# EAGLE schematic MacroPad (EAGLE 9.6.2)
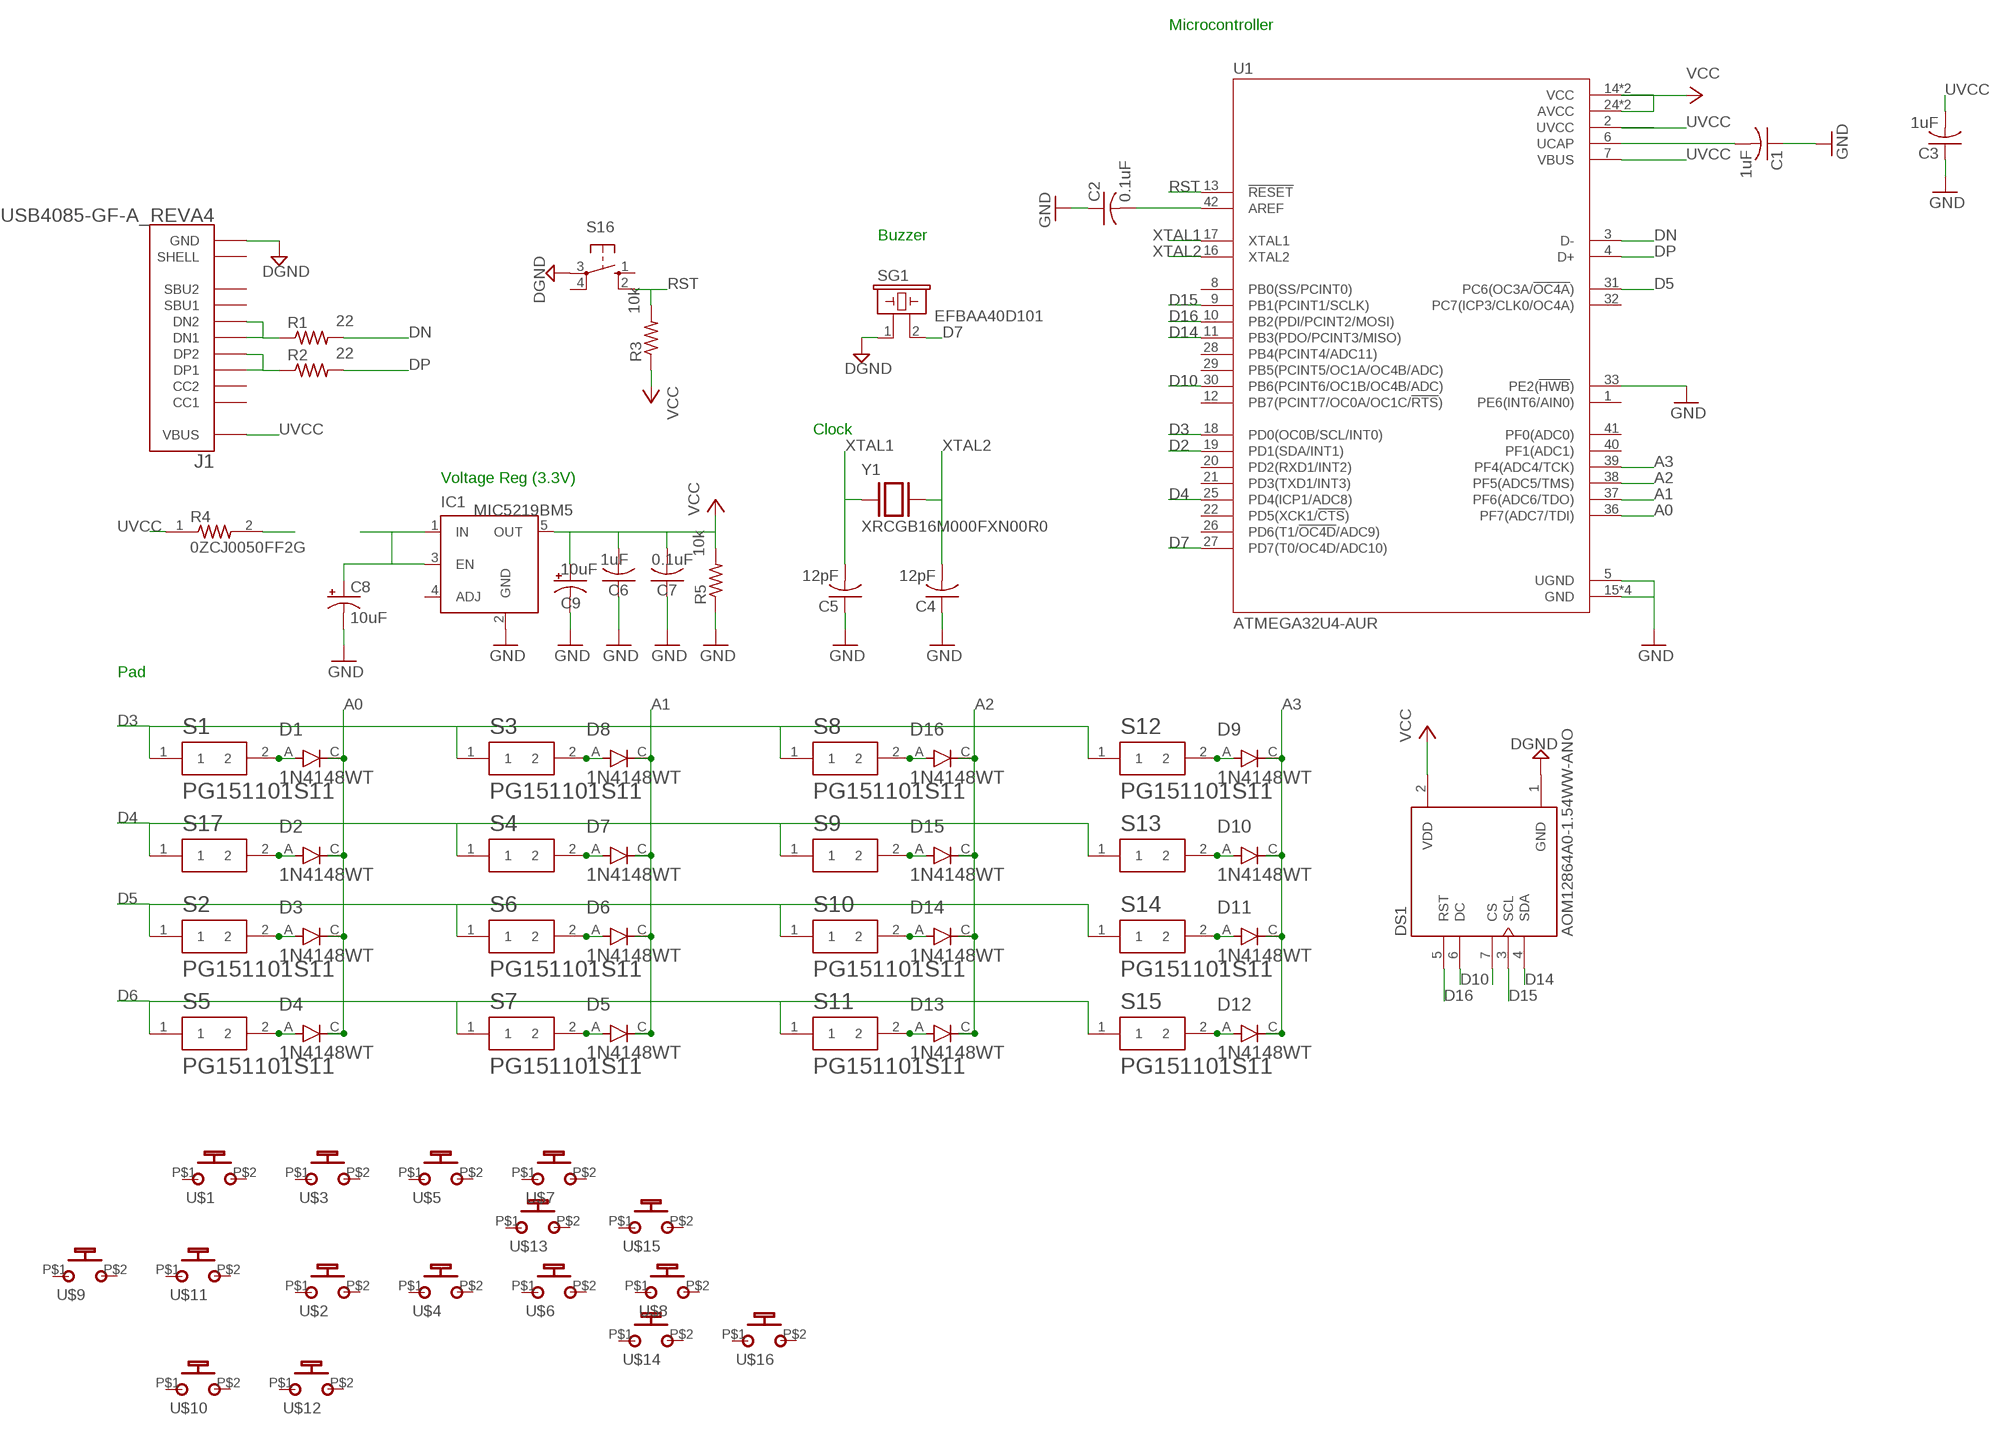
[diagram p0: schematic, sheet 1]

## Parts
C1  1uF  C-USC0603  [C0603]
C2  0.1uF  C-USC0603  [C0603]
C3  1uF  C-USC0603  [C0603]
C4  12pF  C-USC0603  [C0603]
C5  12pF  C-USC0603  [C0603]
C6  1uF  C-USC0603  [C0603]
C7  0.1uF  C-USC0603  [C0603]
C8  10uF  CPOL-US153CLV-0605  [153CLV-0605]
C9  10uF  CPOL-US153CLV-0605  [153CLV-0605]
D1  1N4148WT  [SODFL1608X70N]
D2  1N4148WT  [SODFL1608X70N]
D3  1N4148WT  [SODFL1608X70N]
D4  1N4148WT  [SODFL1608X70N]
D5  1N4148WT  [SODFL1608X70N]
D6  1N4148WT  [SODFL1608X70N]
D7  1N4148WT  [SODFL1608X70N]
D8  1N4148WT  [SODFL1608X70N]
D9  1N4148WT  [SODFL1608X70N]
D10  1N4148WT  [SODFL1608X70N]
D11  1N4148WT  [SODFL1608X70N]
D12  1N4148WT  [SODFL1608X70N]
D13  1N4148WT  [SODFL1608X70N]
D14  1N4148WT  [SODFL1608X70N]
D15  1N4148WT  [SODFL1608X70N]
D16  1N4148WT  [SODFL1608X70N]
DS1  AOM12864A0-1.54WW-ANO  [LCD_AOM12864A0-1.54WW-ANO]
IC1  MIC5219BM5  [SOT23-5]
J1  USB4085-GF-A_REVA4  [GCT_USB4085-GF-A_REVA4]
R1  22  R-US_R0805  [R0805]
R2  22  R-US_R0805  [R0805]
R3  10k  R-US_R0805  [R0805]
R4  0ZCJ0050FF2G  [RESC3216X125N]
R5  10k  R-US_R0805  [R0805]
S1  PG151101S11  [SW_PG151101S11]
S2  PG151101S11  [SW_PG151101S11]
S3  PG151101S11  [SW_PG151101S11]
S4  PG151101S11  [SW_PG151101S11]
S5  PG151101S11  [SW_PG151101S11]
S6  PG151101S11  [SW_PG151101S11]
S7  PG151101S11  [SW_PG151101S11]
S8  PG151101S11  [SW_PG151101S11]
S9  PG151101S11  [SW_PG151101S11]
S10  PG151101S11  [SW_PG151101S11]
S11  PG151101S11  [SW_PG151101S11]
S12  PG151101S11  [SW_PG151101S11]
S13  PG151101S11  [SW_PG151101S11]
S14  PG151101S11  [SW_PG151101S11]
S15  PG151101S11  [SW_PG151101S11]
S16  10-XX  [B3F-10XX]
S17  PG151101S11  [SW_PG151101S11]
SG1  EFBAA40D101  [EFBAA40D101]
U1  ATMEGA32U4-AUR  [QFP80P1200X1200X120-44N]
U$1  MX1A-11NN  [CHERRY_MX1A-11NN_SWITCH]
U$2  MX1A-11NN  [CHERRY_MX1A-11NN_SWITCH]
U$3  MX1A-11NN  [CHERRY_MX1A-11NN_SWITCH]
U$4  MX1A-11NN  [CHERRY_MX1A-11NN_SWITCH]
U$5  MX1A-11NN  [CHERRY_MX1A-11NN_SWITCH]
U$6  MX1A-11NN  [CHERRY_MX1A-11NN_SWITCH]
U$7  MX1A-11NN  [CHERRY_MX1A-11NN_SWITCH]
U$8  MX1A-11NN  [CHERRY_MX1A-11NN_SWITCH]
U$9  MX1A-11NN  [CHERRY_MX1A-11NN_SWITCH]
U$10  MX1A-11NN  [CHERRY_MX1A-11NN_SWITCH]
U$11  MX1A-11NN  [CHERRY_MX1A-11NN_SWITCH]
U$12  MX1A-11NN  [CHERRY_MX1A-11NN_SWITCH]
U$13  MX1A-11NN  [CHERRY_MX1A-11NN_SWITCH]
U$14  MX1A-11NN  [CHERRY_MX1A-11NN_SWITCH]
U$15  MX1A-11NN  [CHERRY_MX1A-11NN_SWITCH]
U$16  MX1A-11NN  [CHERRY_MX1A-11NN_SWITCH]
Y1  XRCGB16M000FXN00R0  [OSC_XRCGB16M000FXN00R0]

## Nets
A0: D1.C D2.C D3.C D4.C U1.36(PF7(ADC7/TDI))
A1: D5.C D6.C D7.C D8.C U1.37(PF6(ADC6/TDO))
A2: D13.C D14.C D15.C D16.C U1.38(PF5(ADC5/TMS))
A3: D9.C D10.C D11.C D12.C U1.39(PF4(ADC4/TCK))
D2: U1.19(PD1(SDA/INT1))
D3: S1.1 S3.1 S8.1 S12.1 U1.18(PD0(OC0B/SCL/INT0))
D4: S4.1 S9.1 S13.1 S17.1 U1.25(PD4(ICP1/ADC8))
D5: S2.1 S6.1 S10.1 S14.1 U1.31(PC6(OC3A/!OC4A!))
D6: S5.1 S7.1 S11.1 S15.1
D7: SG1.2 U1.27(PD7(T0/OC4D/ADC10))
D10: DS1.6(DC) U1.30(PB6(PCINT6/OC1B/OC4B/ADC))
D14: DS1.4(SDA) U1.11(PB3(PDO/PCINT3/MISO))
D15: DS1.3(SCL) U1.9(PB1(PCINT1/SCLK))
D16: DS1.5(RST) U1.10(PB2(PDI/PCINT2/MOSI))
DGND: DS1.1(GND) J1.A1(GND) J1.A12(GND) J1.B1(GND) J1.B12(GND) S16.3(P) SG1.1
DN: R1.2 U1.3(D-)
DP: R2.2 U1.4(D+)
GND: C1.1 C2.1 C3.1 C4.1 C5.1 C6.1 C7.1 C8.- C9.- IC1.2(GND) R5.1 U1.5(UGND) U1.15(GND) U1.23(GND) U1.33(PE2(!HWB!)) U1.35(GND) U1.43(GND)
N$1: D1.A S1.2
N$2: D2.A S17.2
N$3: D3.A S2.2
N$4: D4.A S5.2
N$5: D8.A S3.2
N$6: D7.A S4.2
N$7: D6.A S6.2
N$8: D5.A S7.2
N$9: D16.A S8.2
N$10: D15.A S9.2
N$11: D14.A S10.2
N$12: D13.A S11.2
N$13: D9.A S12.2
N$14: D10.A S13.2
N$15: D11.A S14.2
N$16: D12.A S15.2
N$17: R4.2
N$20: J1.A7(DN1) J1.B7(DN2) R1.1
N$21: J1.A6(DP1) J1.B6(DP2) R2.1
N$22: C1.2 U1.6(UCAP)
N$23: C2.2 U1.42(AREF)
N$24: DS1.7(CS)
N$25: C8.+ IC1.1(IN) IC1.3(EN)
RST: R3.2 S16.2(S1) U1.13(!RESET)
UVCC: C3.2 J1.A4(VBUS) J1.A9(VBUS) J1.B4(VBUS) J1.B9(VBUS) R4.1 U1.2(UVCC) U1.7(VBUS)
VCC: C6.2 C7.2 C9.+ DS1.2(VDD) IC1.5(OUT) R3.1 R5.2 U1.14(VCC) U1.24(AVCC) U1.34(VCC) U1.44(AVCC)
XTAL1: C5.2 U1.17(XTAL1) Y1.1
XTAL2: C4.2 U1.16(XTAL2) Y1.3
Unconnected: IC1.4(ADJ) J1.A5(CC1) J1.A8(SBU1) J1.B5(CC2) J1.B8(SBU2) J1.S1(SHELL) J1.S2(SHELL) J1.S3(SHELL) J1.S4(SHELL) S16.1(S) S16.4(P1) U1.1(PE6(INT6/AIN0)) U1.8(PB0(SS/PCINT0)) U1.12(PB7(PCINT7/OC0A/OC1C/!RTS!)) U1.20(PD2(RXD1/INT2)) U1.21(PD3(TXD1/INT3)) U1.22(PD5(XCK1/!CTS!)) U1.26(PD6(T1/!OC4D!/ADC9)) U1.28(PB4(PCINT4/ADC11)) U1.29(PB5(PCINT5/OC1A/OC4B/ADC)) U1.32(PC7(ICP3/CLK0/OC4A)) U1.40(PF1(ADC1)) U1.41(PF0(ADC0)) U$1.P$1(P) U$1.P$2(S) U$2.P$1(P) U$2.P$2(S) U$3.P$1(P) U$3.P$2(S) U$4.P$1(P) U$4.P$2(S) U$5.P$1(P) U$5.P$2(S) U$6.P$1(P) U$6.P$2(S) U$7.P$1(P) U$7.P$2(S) U$8.P$1(P) U$8.P$2(S) U$9.P$1(P) U$9.P$2(S) U$10.P$1(P) U$10.P$2(S) U$11.P$1(P) U$11.P$2(S) U$12.P$1(P) U$12.P$2(S) U$13.P$1(P) U$13.P$2(S) U$14.P$1(P) U$14.P$2(S) U$15.P$1(P) U$15.P$2(S) U$16.P$1(P) U$16.P$2(S)

## Notes on the sheet
- Microcontroller
- Buzzer
- Clock
- Voltage Reg (3.3V)
- Pad

## Library data of the parts
C1-C7 = rcl:C-US: CAPACITOR, American symbol; SPICEPREFIX: C
C8 C9 = rcl:CPOL-US: POLARIZED CAPACITOR, American symbol; SPICEPREFIX: C
D1-D16 = 1N4148WT:1N4148WT: Diode Switching 100V 0.125A 2-Pin SOD-523 Check availability <https://pricing.snapeda.com/parts/1N4148WT/ON%20Semiconductor/view-part?ref=eda>; AVAILABILITY: In Stock; DESCRIPTION: Diode Standard 75 V 200mA Surface Mount SOD-523F; MF: ON Semiconductor; MP: 1N4148WT; PACKAGE: SOD-523-2 ON Semiconductor; PRICE: None; PURCHASE-URL: https://pricing.snapeda.com/search/part/1N4148WT/?ref=eda
DS1 = AOM12864A0-1.54WW-ANO:AOM12864A0-1.54WW-ANO: Non-Touch Graphic LCD Display Module - White OLED SPI 1.54in (39.12mm) 128 x 64 Check availability <https://pricing.snapeda.com/parts/AOM12864A0-1.54WW-ANO/Orient%20Display/view-part?ref=eda>; AVAILABILITY: In Stock; DESCRIPTION: Non-Touch Graphic LCD Display Module - White OLED SPI 1.54 (39.12mm) 128 x 64; MF: Orient Display; MP: AOM12864A0-1.54WW-ANO; PACKAGE: None; PRICE: None; PURCHASE-URL: https://pricing.snapeda.com/search/part/AOM12864A0-1.54WW-ANO/?ref=eda
IC1 = MIC5219BM5:MIC5219BM5: VOLTAGE REGULATOR Check availability <https://pricing.snapeda.com/parts/MIC5219BM5/Micrel/view-part?ref=eda>; AVAILABILITY: In Stock; DESCRIPTION: Linear Voltage Regulator IC Positive Adjustable 1 Output 500mA SOT-23-5; MF: Micrel; MP: MIC5219BM5; PACKAGE: SOT-753 Micrel; PRICE: None; PURCHASE-URL: https://pricing.snapeda.com/search/part/MIC5219BM5/?ref=eda
J1 = USB4085-GF-A_REVA4:USB4085-GF-A_REVA4: Check availability <https://pricing.snapeda.com/parts/USB4085-GF-A/Global%20Connector%20Technology/view-part?ref=eda>; AVAILABILITY: In Stock; DESCRIPTION: USB-C (USB TYPE-C) USB 2.0 Receptacle Connector 24 (16+8 Dummy) Position Through Hole, Right Angle, low cost, 3.46mm profile, 16 pin, horizontal, Top mount; MF: Global Connector Technology; MP: USB4085-GF-A; PACKAGE: None; PRICE: None; PURCHASE-URL: https://pricing.snapeda.com/search/part/USB4085-GF-A/?ref=eda
R1-R3 R5 = rcl:R-US_: RESISTOR, American symbol; SPICEPREFIX: R
R4 = 0ZCJ0050FF2G:0ZCJ0050FF2G: PTC Resettable Fuse100A 8VDC T/R Check availability <https://pricing.snapeda.com/parts/0ZCJ0050FF2G/Bel%20Fuse/view-part?ref=eda>; AVAILABILITY: In Stock; DESCRIPTION: 1206 SMT PPTC | 0.50 Ih | 8V; MF: Bel Fuse; MP: 0ZCJ0050FF2G; PACKAGE: 1206 Bel Fuse; PRICE: None; PURCHASE-URL: https://pricing.snapeda.com/search/part/0ZCJ0050FF2G/?ref=eda
S1-S15 S17 = PG151101S11:PG151101S11: Keyswitch Check availability <https://pricing.snapeda.com/parts/PG151101S11/Kailh/view-part?ref=eda>; AVAILABILITY: Not in stock; MF: Kailh; MP: PG151101S11; PACKAGE: Package; PRICE: None
S16 = switch-omron:10-XX: OMRON SWITCH; MPN: B3F-1000; OC_FARNELL: 176432; OC_NEWARK: 36M3542
SG1 = buzzer:EFB?: Piezoelectric Acoustic Transducer Source: Panbasonic .. 2SC1685.pdf; OC_FARNELL: unknown; OC_NEWARK: unknown
U1 = ATMEGA32U4-AUR:ATMEGA32U4-AUR: ATmega Series 16 MHz 32 KB Flash 2.5 KB SRAM 8-Bit Microcontroller - TQFP-44 Check availability <https://pricing.snapeda.com/parts/ATMEGA32U4-AUR/Microchip%20Technology/view-part?ref=eda>; AVAILABILITY: In Stock; DESCRIPTION: AVR AVR® ATmega Microcontroller IC 8-Bit 16MHz 32KB (16K x 16) FLASH 44-TQFP (10x10); MF: Microchip Technology; MP: ATMEGA32U4-AUR; PACKAGE: TQFP-44 Microchip; PRICE: None; PURCHASE-URL: https://pricing.snapeda.com/search/part/ATMEGA32U4-AUR/?ref=eda
U$1-U$16 = MX1A-11NN:MX1A-11NN: Check availability <https://pricing.snapeda.com/parts/MX1A-11NN/Cherry/view-part?ref=eda>; AVAILABILITY: In Stock; DESCRIPTION: Pushbutton Switch SPST-NO Keyswitch Panel Mount, Front; MF: Cherry; MP: MX1A-11NN; PACKAGE: None; PRICE: None; PURCHASE-URL: https://pricing.snapeda.com/search/part/MX1A-11NN/?ref=eda
Y1 = XRCGB16M000FXN00R0:XRCGB16M000FXN00R0: 27MHz ±20ppm Crystal 6pF 150 Ohms 4-SMD, No Lead Check availability <https://pricing.snapeda.com/parts/XRCGB16M000FXN00R0/Murata%20Electronics/view-part?ref=eda>; AVAILABILITY: In Stock; DESCRIPTION: 16 MHz ±40ppm Crystal 6pF 200 Ohms 4-SMD, No Lead; MF: Murata Electronics; MP: XRCGB16M000FXN00R0; PACKAGE: SMD-4 Murata; PRICE: None; PURCHASE-URL: https://pricing.snapeda.com/search/part/XRCGB16M000FXN00R0/?ref=eda